# EAGLE schematic Arduino_Due_6-channel_servo_current_sensor_v19 (EAGLE 9.7.0)
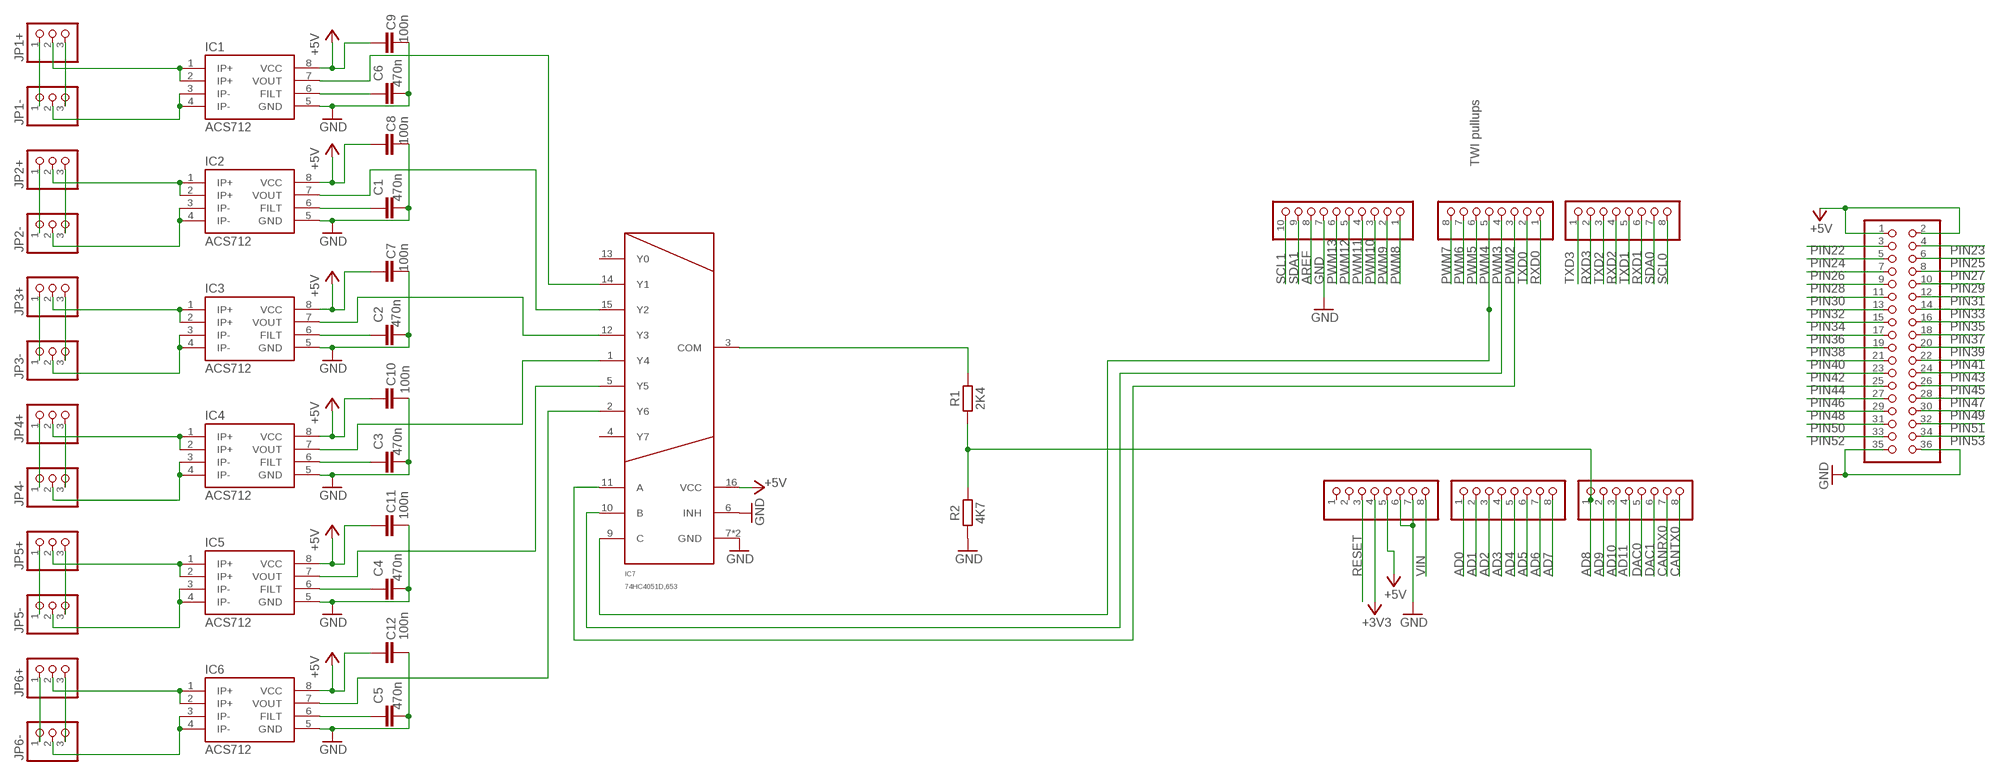
[diagram p0: schematic, sheet 1]

## Parts
ADCH  FH254-108DF08500V  1683_20TW-536  [1X08]
ADCL  FH254-108DF08500V  1683_20TW-536  [1X08]
C1  470n  C_CHIP-1206(3216-METRIC)  [CAPC3216X135]
C2  470n  C_CHIP-1206(3216-METRIC)  [CAPC3216X135]
C3  470n  C_CHIP-1206(3216-METRIC)  [CAPC3216X135]
C4  470n  C_CHIP-1206(3216-METRIC)  [CAPC3216X135]
C5  470n  C_CHIP-1206(3216-METRIC)  [CAPC3216X135]
C6  470n  C_CHIP-1206(3216-METRIC)  [CAPC3216X135]
C7  100n  C_CHIP-1206(3216-METRIC)  [CAPC3216X135]
C8  100n  C_CHIP-1206(3216-METRIC)  [CAPC3216X135]
C9  100n  C_CHIP-1206(3216-METRIC)  [CAPC3216X135]
C10  100n  C_CHIP-1206(3216-METRIC)  [CAPC3216X135]
C11  100n  C_CHIP-1206(3216-METRIC)  [CAPC3216X135]
C12  100n  C_CHIP-1206(3216-METRIC)  [CAPC3216X135]
COMMUNICATION  FH254-108DF08500V  1683_20TW-536  [1X08]
IC1  ACS712  [SO08]
IC2  ACS712  [SO08]
IC3  ACS712  [SO08]
IC4  ACS712  [SO08]
IC5  ACS712  [SO08]
IC6  ACS712  [SO08]
IC7  74HC4051D,653  [SO16]
JP1+  PINHD-1X3  [1X03]
JP1-  PINHD-1X3  [1X03]
JP2+  PINHD-1X3  [1X03]
JP2-  PINHD-1X3  [1X03]
JP3+  PINHD-1X3  [1X03]
JP3-  PINHD-1X3  [1X03]
JP4+  PINHD-1X3  [1X03]
JP4-  PINHD-1X3  [1X03]
JP5+  PINHD-1X3  [1X03]
JP5-  PINHD-1X3  [1X03]
JP6+  PINHD-1X3  [1X03]
JP6-  PINHD-1X3  [1X03]
POWER  FH254-108DF08500V  1683_20TW-536  [1X08]
PWMH  FH254-110DF08500V  1684_20TW-537  [1X10]
PWML  FH254-108DF08500V  1683_20TW-536  [1X08]
R1  2K4  R_CHIP-1206(3216-METRIC)  [RESC3216X70]
R2  4K7  R_CHIP-1206(3216-METRIC)  [RESC3216X70]
XIO  18x2F-H8.5  1756_12TW323  [2X18]

## Nets
1IP+: IC1.1(IP+) IC1.2(IP+) JP1+.2
1IP-: IC1.3(IP-) IC1.4(IP-) JP1-.2
2IP+: IC2.1(IP+) IC2.2(IP+) JP2+.2
2IP-: IC2.3(IP-) IC2.4(IP-) JP2-.2
3IP+: IC3.1(IP+) IC3.2(IP+) JP3+.2
3IP-: IC3.3(IP-) IC3.4(IP-) JP3-.2
4IP+: IC4.1(IP+) IC4.2(IP+) JP4+.2
4IP-: IC4.3(IP-) IC4.4(IP-) JP4-.2
5IP+: IC5.1(IP+) IC5.2(IP+) JP5+.2
5IP-: IC5.3(IP-) IC5.4(IP-) JP5-.2
6IP+: IC6.1(IP+) IC6.2(IP+) JP6+.2
6IP-: IC6.3(IP-) IC6.4(IP-) JP6-.2
+3V3: POWER.4
+5V: C7.1 C8.1 C9.1 C10.1 C11.1 C12.1 IC1.8(VCC) IC2.8(VCC) IC3.8(VCC) IC4.8(VCC) IC5.8(VCC) IC6.8(VCC) IC7.16(VCC) POWER.5 XIO.1 XIO.2
AD0: ADCL.1
AD1: ADCL.2
AD2: ADCL.3
AD3: ADCL.4
AD4: ADCL.5
AD5: ADCL.6
AD6: ADCL.7
AD7: ADCL.8
AD8: ADCH.1 R1.1 R2.2
AD9: ADCH.2
AD10: ADCH.3
AD11: ADCH.4
AREF: PWMH.8
CANRX0: ADCH.7
CANTX0: ADCH.8
DAC0: ADCH.5
DAC1: ADCH.6
FILTER1: C6.1 IC1.6(FILT)
FILTER2: C1.1 IC2.6(FILT)
FILTER3: C2.1 IC3.6(FILT)
FILTER4: C3.1 IC4.6(FILT)
FILTER5: C4.1 IC5.6(FILT)
FILTER6: C5.1 IC6.6(FILT)
GND: C1.2 C2.2 C3.2 C4.2 C5.2 C6.2 C7.2 C8.2 C9.2 C10.2 C11.2 C12.2 IC1.5(GND) IC2.5(GND) IC3.5(GND) IC4.5(GND) IC5.5(GND) IC6.5(GND) IC7.6(INH) IC7.7(GND) IC7.8(GND) POWER.6 POWER.7 PWMH.7 R2.1 XIO.35 XIO.36
N$1: JP6+.1 JP6-.1
N$2: JP6+.3 JP6-.3
N$5: JP5+.1 JP5-.1
N$6: JP5+.3 JP5-.3
N$7: JP4+.1 JP4-.1
N$8: JP4+.3 JP4-.3
N$9: JP3+.1 JP3-.1
N$10: JP3+.3 JP3-.3
N$11: JP2+.1 JP2-.1
N$12: JP2+.3 JP2-.3
N$13: JP1+.1 JP1-.1
N$14: JP1+.3 JP1-.3
PIN22: XIO.3
PIN23: XIO.4
PIN24: XIO.5
PIN25: XIO.6
PIN26: XIO.7
PIN27: XIO.8
PIN28: XIO.9
PIN29: XIO.10
PIN30: XIO.11
PIN31: XIO.12
PIN32: XIO.13
PIN33: XIO.14
PIN34: XIO.15
PIN35: XIO.16
PIN36: XIO.17
PIN37: XIO.18
PIN38: XIO.19
PIN39: XIO.20
PIN40: XIO.21
PIN41: XIO.22
PIN42: XIO.23
PIN43: XIO.24
PIN44: XIO.25
PIN45: XIO.26
PIN46: XIO.27
PIN47: XIO.28
PIN48: XIO.29
PIN49: XIO.30
PIN50: XIO.31
PIN51: XIO.32
PIN52: XIO.33
PIN53: XIO.34
PWM2: IC7.11(A) PWML.3
PWM3: IC7.10(B) PWML.4
PWM4: IC7.9(C) PWML.5
PWM5: PWML.6
PWM6: PWML.7
PWM7: PWML.8
PWM8: PWMH.1
PWM9: PWMH.2
PWM10: PWMH.3
PWM11: PWMH.4
PWM12: PWMH.5
PWM13: PWMH.6
RESET: POWER.3
RXD0: PWML.1
RXD1: COMMUNICATION.6
RXD2: COMMUNICATION.4
RXD3: COMMUNICATION.2
SCL0: COMMUNICATION.8
SCL1: PWMH.10
SDA0: COMMUNICATION.7
SDA1: PWMH.9
TXD0: PWML.2
TXD1: COMMUNICATION.5
TXD2: COMMUNICATION.3
TXD3: COMMUNICATION.1
VIN: POWER.8
VIOUT1: IC1.7(VOUT) IC7.14(Y1)
VIOUT2: IC2.7(VOUT) IC7.15(Y2)
VIOUT3: IC3.7(VOUT) IC7.12(Y3)
VIOUT4: IC4.7(VOUT) IC7.1(Y4)
VIOUT5: IC5.7(VOUT) IC7.5(Y5)
VIOUT6: IC6.7(VOUT) IC7.2(Y6)
Z-COMMON: IC7.3(COM) R1.2
Unconnected: IC7.4(Y7) IC7.13(Y0) POWER.1 POWER.2

## Notes on the sheet
- ETH-CS | SD-CS | UTXD | URXD | TWCK1 | TWD1
- TWI pullups
- TWCK0 | TWD0 | AREF | 13 | 12 | 11 | 10 | 9 | 8 | 7 | 6 | 5 | 4 | 3 | 2 | 1 | 0 | 21 | 20 | 19 | 18 | 17 | 16 | 15 | 14
- 22 | 23
- 24 | 25
- 26 | 27
- 28 | 29
- 30 | 31
- 32 | 33
- 34 | 35
- 36 | 37
- 38 | 39
- 40 | 41
- 42 | 43
- 44 | 45
- 46 | 47
- 48 | 49
- 50 | 51
- 52
- AD7 | AD6 | AD5 | AD4 | AD3 | AD2 | AD1 | AD0
- IOREF

## Library data of the parts
ADCH ADCL COMMUNICATION POWER PWML = Connettori:1683_20TW-536: Female Gray Connector strip for Arduino 3V3 bases - 8x1 F V h 8,5 p2,54mm; MONTHLY_USAGE: _____; PART_NUMBER: 20TW-536; PRICE: _____; SUPPLIER: _____; TYPE: Connettori
C1-C12 = Capacitor:C: Capacitor - Generic; CATEGORY: Capacitor
IC1-IC6 = ACS712:ACS712: Hall-effect-based isolated linear current sensor; PROD_ID: IC-08964
IC7 = 74HC4051D_653:74HC4051D,653: 1 Circuit IC Switch 8:1 120Ohm 16-SO +/- 4V; PARTNO: 1727-2807-1-ND
JP1+ JP1- JP2+ JP2- JP3+ JP3- JP4+ JP4- JP5+ JP5- JP6+ JP6- = Connector:PINHD-1X3: PIN HEADER; CATEGORY: CONNECTOR; SUB-CATEGORY: PIN-HEADER
PWMH = Connettori:1684_20TW-537: Female Gray Connector strip for Arduino 3V3 bases - 10x1 F V h 8,5 p2,54mm; MONTHLY_USAGE: _____; PART_NUMBER: 20TW-537; PRICE: _____; SUPPLIER: _____; TYPE: Connettori
R1 R2 = Resistor:R: Resistor Fixed - Generic; CATEGORY: Resistor; SUB-CATEGORY: Fixed
XIO = Connettori:1756_12TW323: Female Gray Connector strip for Arduino 3V3 bases 18x2 F V h 8,5 p2,54; MONTHLY_USAGE: _____; PART_NUMBER: 12TW323; PRICE: _____; SUPPLIER: _____; TYPE: Connettori

## Net classes
0 default: width 0.203 mm, drill 0.406 mm, clearance 0.203 mm
1 USB: width 0.203 mm, drill 0.406 mm, clearance 0.203 mm
2 gnd: width 0.203 mm, drill 0.406 mm, clearance 0.203 mm
3 usbvcc: width 0.203 mm, drill 0.406 mm, clearance 0.203 mm
4 USBpair: width 0.254 mm, drill 0.406 mm, clearance 0.61 mm to class 0, clearance 0.61 mm to class 1, clearance 0.61 mm to class 2, clearance 0.61 mm to class 3